# EAGLE design fb_in_8_230V (EAGLE 5.00)
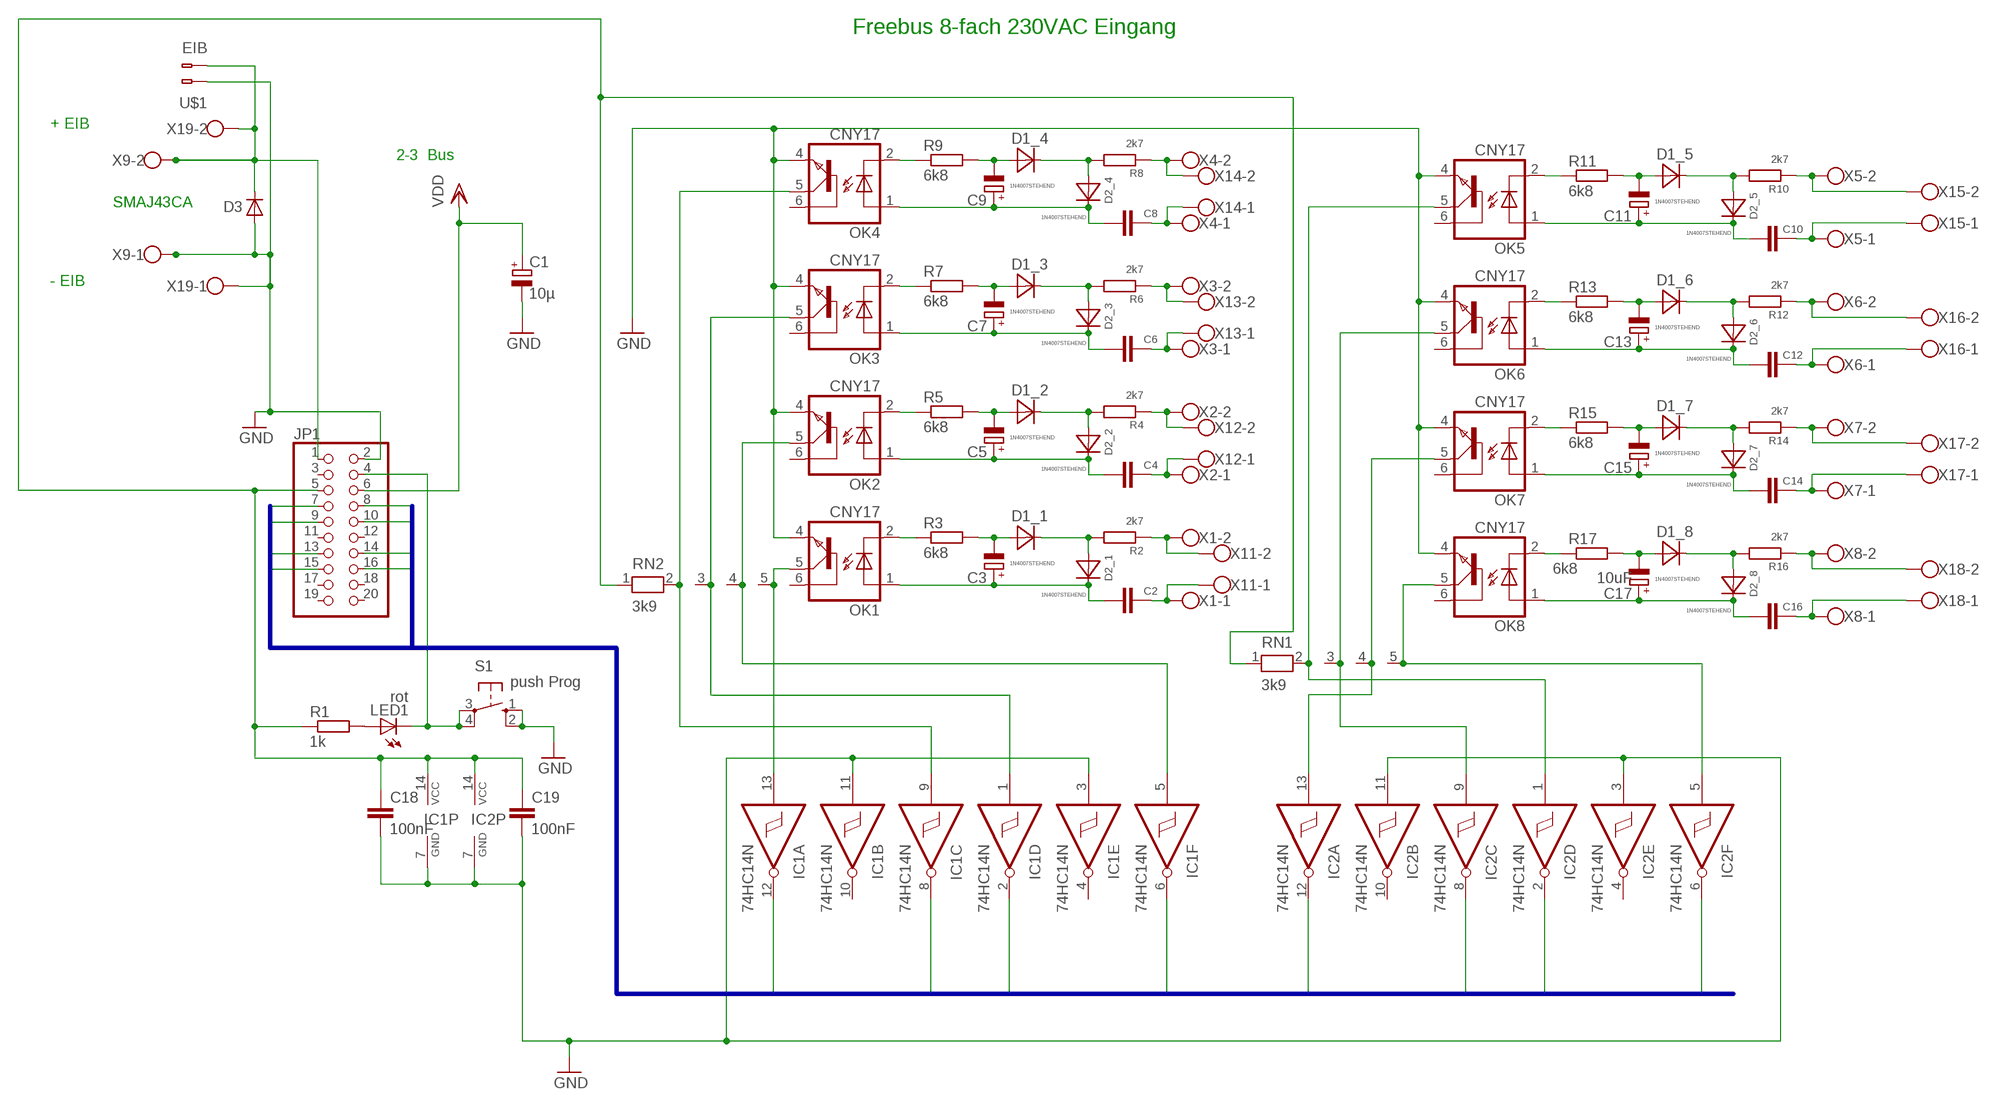
[diagram p0: schematic, sheet 1]

## Parts
C1  10µ  CPOL-EUE3.5-8  [E3,5-8]
C2  C-EU075-063X106  [C075-063X106]
C3  CPOL-EUE2-4  [E2-4]
C4  C-EU075-063X106  [C075-063X106]
C5  CPOL-EUE2-4  [E2-4]
C6  C-EU075-063X106  [C075-063X106]
C7  CPOL-EUE2-4  [E2-4]
C8  C-EU075-063X106  [C075-063X106]
C9  CPOL-EUE2-4  [E2-4]
C10  C-EU075-063X106  [C075-063X106]
C11  CPOL-EUE2-4  [E2-4]
C12  C-EU075-063X106  [C075-063X106]
C13  CPOL-EUE2-4  [E2-4]
C14  C-EU075-063X106  [C075-063X106]
C15  CPOL-EUE2-4  [E2-4]
C16  47nF  C-EU075-063X106  [C075-063X106]
C17  10uF  CPOL-EUE2-4  [E2-4]
C18  100nF  C-EU050-024X044  [C050-024X044]
C19  100nF  C-EU050-024X044  [C050-024X044]
D1_1  1N4007STEHEND  [RAD2,5]
D1_2  1N4007STEHEND  [RAD2,5]
D1_3  1N4007STEHEND  [RAD2,5]
D1_4  1N4007STEHEND  [RAD2,5]
D1_5  1N4007STEHEND  [RAD2,5]
D1_6  1N4007STEHEND  [RAD2,5]
D1_7  1N4007STEHEND  [RAD2,5]
D1_8  1N4007STEHEND  [RAD2,5]
D2_1  1N4007STEHEND  [RAD2,5]
D2_2  1N4007STEHEND  [RAD2,5]
D2_3  1N4007STEHEND  [RAD2,5]
D2_4  1N4007STEHEND  [RAD2,5]
D2_5  1N4007STEHEND  [RAD2,5]
D2_6  1N4007STEHEND  [RAD2,5]
D2_7  1N4007STEHEND  [RAD2,5]
D2_8  1N4007STEHEND  [RAD2,5]
D3  D-SMB  [SMB]
IC1  74HC14N  [DIL14]
IC2  74HC14N  [DIL14]
JP1  PINHD-2X10  [2X10]
LED1  rot  LED3MM  [LED3MM]
OK1  CNY17  [DIL06]
OK2  CNY17  [DIL06]
OK3  CNY17  [DIL06]
OK4  CNY17  [DIL06]
OK5  CNY17  [DIL06]
OK6  CNY17  [DIL06]
OK7  CNY17  [DIL06]
OK8  CNY17  [DIL06]
R1  1k  R-EU_0204/7  [0204/7]
R2  2k7  R-EU_0207/2V  [0207/2V]
R3  6k8  R-EU_0207/2V  [0207/2V]
R4  2k7  R-EU_0207/2V  [0207/2V]
R5  6k8  R-EU_0207/2V  [0207/2V]
R6  2k7  R-EU_0207/2V  [0207/2V]
R7  6k8  R-EU_0207/2V  [0207/2V]
R8  2k7  R-EU_0207/2V  [0207/2V]
R9  6k8  R-EU_0207/2V  [0207/2V]
R10  2k7  R-EU_0207/2V  [0207/2V]
R11  6k8  R-EU_0207/2V  [0207/2V]
R12  2k7  R-EU_0207/2V  [0207/2V]
R13  6k8  R-EU_0207/2V  [0207/2V]
R14  2k7  R-EU_0207/2V  [0207/2V]
R15  6k8  R-EU_0207/2V  [0207/2V]
R16  2k7  R-EU_0207/2V  [0207/2V]
R17  6k8  R-EU_0207/2V  [0207/2V]
RN1  3k9  RN04  [RN-5]
RN2  3k9  RN04  [RN-5]
S1  push Prog  10-XX  [B3F-10XX]
U$1  EIB  [BUSKLEMME243-724]
X1  W237-102W2POL5_08  [W237-132]
X2  W237-102W2POL5_08  [W237-132]
X3  W237-102W2POL5_08  [W237-132]
X4  W237-102W2POL5_08  [W237-132]
X5  W237-102W2POL5_08  [W237-132]
X6  W237-102W2POL5_08  [W237-132]
X7  W237-102W2POL5_08  [W237-132]
X8  W237-102W2POL5_08  [W237-132]
X9  W237-102W2POL5_08  [W237-132]
X11  W237-102AKL007-2P  [AKL007-02]
X12  W237-102AKL007-2P  [AKL007-02]
X13  W237-102AKL007-2P  [AKL007-02]
X14  W237-102AKL007-2P  [AKL007-02]
X15  W237-102AKL007-2P  [AKL007-02]
X16  W237-102AKL007-2P  [AKL007-02]
X17  W237-102AKL007-2P  [AKL007-02]
X18  W237-102AKL007-2P  [AKL007-02]
X19  W237-102AKL007-2P  [AKL007-02]

## Nets
230+_1: C2.1 C3.+ D2_1.C OK1.1(A)
230+_2: C4.1 C5.+ D2_2.C OK2.1(A)
230+_3: C6.1 C7.+ D2_3.C OK3.1(A)
230+_4: C8.1 C9.+ D2_4.C OK4.1(A)
230+_5: C10.1 C11.+ D2_5.C OK5.1(A)
230+_6: C12.1 C13.+ D2_6.C OK6.1(A)
230+_7: C14.1 C15.+ D2_7.C OK7.1(A)
230+_8: C16.1 C17.+ D2_8.C OK8.1(A)
230-_1: C3.- D1_1.A R3.2
230-_2: C5.- D1_2.A R5.2
230-_3: C7.- D1_3.A R7.2
230-_4: C9.- D1_4.A R9.2
230-_5: C11.- D1_5.A R11.2
230-_6: C13.- D1_6.A R13.2
230-_7: C15.- D1_7.A R15.2
230-_8: C17.- D1_8.A R17.2
230N_1: D1_1.C D2_1.A R2.2
230N_2: D1_2.C D2_2.A R4.2
230N_3: D1_3.C D2_3.A R6.2
230N_4: D1_4.C D2_4.A R8.2
230N_5: D1_5.C D2_5.A R10.2
230N_6: D1_6.C D2_6.A R12.2
230N_7: D1_7.C D2_7.A R14.2
230N_8: D1_8.C D2_8.A R16.2
GND: C1.- C18.2 C19.2 D3.2(A) IC1.3(E:I) IC1.7(P:GND) IC1.11(B:I) IC2.3(E:I) IC2.7(P:GND) IC2.11(B:I) JP1.2 OK1.4(EMI) OK2.4(EMI) OK3.4(EMI) OK4.4(EMI) OK5.4(EMI) OK6.4(EMI) OK7.4(EMI) OK8.4(EMI) S1.1(S) S1.2(S1) U$1.1(B-1) X9.1 X19.1
IO1: IC1.12(A:O) JP1.7
IO2: IC1.6(F:O) JP1.8
IO3: IC1.2(D:O) JP1.9
IO4: IC1.8(C:O) JP1.10
IO5: IC2.2(D:O) JP1.13
IO6: IC2.8(C:O) JP1.14
IO7: IC2.12(A:O) JP1.15
IO8: IC2.6(F:O) JP1.16
N$1: C8.2 X4.1 X14.1
N$2: R8.1 X4.2 X14.2
N$3: C6.2 X3.1 X13.1
N$4: R6.1 X3.2 X13.2
N$5: C4.2 X2.1 X12.1
N$6: R4.1 X2.2 X12.2
N$7: C2.2 X1.1 X11.1
N$8: R2.1 X1.2 X11.2
N$9: R12.1 X6.2 X16.2
N$10: C12.2 X6.1 X16.1
N$11: R14.1 X7.2 X17.2
N$12: C16.2 X8.1 X18.1
N$13: R10.1 X5.2 X15.2
N$14: C10.2 X5.1 X15.1
N$15: C14.2 X7.1 X17.1
N$16: R16.1 X8.2 X18.2
N$18: IC2.1(D:I) OK5.5(COL) RN1.2
N$19: IC2.9(C:I) OK6.5(COL) RN1.3
N$20: D3.1(C) JP1.1 U$1.2(B-2) X9.2 X19.2
N$21: IC2.13(A:I) OK7.5(COL) RN1.4
N$22: IC2.5(F:I) OK8.5(COL) RN1.5
N$23: IC1.13(A:I) OK1.5(COL) RN2.5
N$25: IC1.5(F:I) OK2.5(COL) RN2.4
N$27: JP1.4 LED1.K(C) S1.3(P) S1.4(P1)
N$28: LED1.A R1.2
N$29: IC1.1(D:I) OK3.5(COL) RN2.3
N$30: IC1.9(C:I) OK4.5(COL) RN2.2
OPT_1: OK1.2(C) R3.1
OPT_2: OK2.2(C) R5.1
OPT_3: OK3.2(C) R7.1
OPT_4: OK4.2(C) R9.1
OPT_5: OK5.2(C) R11.1
OPT_6: OK6.2(C) R13.1
OPT_7: OK7.2(C) R15.1
OPT_8: OK8.2(C) R17.1
VCC: C18.1 C19.1 IC1.14(P:VCC) IC2.14(P:VCC) JP1.5 R1.1 RN1.1 RN2.1
VDD: C1.+ JP1.6
Unconnected: IC1.4(E:O) IC1.10(B:O) IC2.4(E:O) IC2.10(B:O) JP1.3 JP1.11 JP1.12 JP1.17 JP1.18 JP1.19 JP1.20 OK1.6(BAS) OK2.6(BAS) OK3.6(BAS) OK4.6(BAS) OK5.6(BAS) OK6.6(BAS) OK7.6(BAS) OK8.6(BAS)

## Buses
IO[1..8]

## Notes on the sheet
- Freebus 8-fach 230VAC Eingang
- + EIB
- 2-3  Bus
- SMAJ43CA
- - EIB

## Library data of the parts
C1 C3 C5 C7 C9 C11 C13 C15 C17 = rcl:CPOL-EU: POLARIZED CAPACITOR, European symbol
C2 C4 C6 C8 C10 C12 C14 C16 C18 C19 = rcl:C-EU: CAPACITOR, European symbol
D1_1-D1_8 D2_1-D2_8 = diode:1N4007
D3 = semicon-smd-ipc:D-: DIODE unfilled
IC1 IC2 = 74xx-eu:74*14: Hex schmitt trigger INVERTER
JP1 = pinhead:PINHD-2X10: PIN HEADER
LED1 = led:LED: LED OSRAM: - CHIPLED LG R971, LG N971, LY N971, LG Q971, LY Q971, LO R971, LY R971 LH N974, LH R974 LS Q976, LO Q976, LY Q976 LO Q996 - Hyper CHIPLED LW Q18S LB Q993, LB Q99A, LB R99A - SideLED LS A670, LO A670, LY A670, LG A670, LP A670 LB A673, LV A673, LT A673, LW A673 LH A674 LY A675 LS A676, LA A676, LO A676, LY A676, LW A676 LS A679, LY A679, LG A679 - Hyper Micro SIDELED® LS Y876, LA Y876, LO Y876, LY Y876 LT Y87S - SmartLED LW L88C, LW L88S LB L89C, LB L89S, LG L890 LS L89K, LO L89K, LY L89K LS L896, LA L896, LO L896, LY L896 - TOPLED LS T670, LO T670, LY T670, LG T670, LP T670 LSG T670, LSP T670, LSY T670, LOP T670, LYG T670 LG T671, LOG T671, LSG T671 LB T673, LV T673, LT T673, LW T673 LH T674 LS T676, LA T676, LO T676, LY T676, LB T676, LH T676, LSB T676, LW T676 LB T67C, LV T67C, LT T67C, LS T67K, LO T67K, LY T67K, LW E67C LS E67B, LA E67B, LO E67B, LY E67B, LB E67C, LV E67C, LT E67C LW T67C LS T679, LY T679, LG T679 LS T770, LO T770, LY T770, LG T770, LP T770 LB T773, LV T773, LT T773, LW T773 LH T774 LS E675, LA E675, LY E675, LS T675 LS T776, LA T776, LO T776, LY T776, LB T776 LHGB T686 LT T68C, LB T68C - Hyper Mini TOPLED® LB M676 - Mini TOPLED Santana® LG M470 LS M47K, LO M47K, LY M47K Source: http://www.osram.convergy.de - LUMILED® LXK2-PW12-R00, LXK2-PW12-S00, LXK2-PW14-U00, LXK2-PW14-V00 LXK2-PM12-R00, LXK2-PM12-S00, LXK2-PM14-U00 LXK2-PE12-Q00, LXK2-PE12-R00, LXK2-PE12-S00, LXK2-PE14-T00, LXK2-PE14-U00 LXK2-PB12-K00, LXK2-PB12-L00, LXK2-PB12-M00, LXK2-PB14-N00, LXK2-PB14-P00, LXK2-PB14-Q00 LXK2-PR12-L00, LXK2-PR12-M00, LXK2-PR14-Q00, LXK2-PR14-R00 LXK2-PD12-Q00, LXK2-PD12-R00, LXK2-PD12-S00 LXK2-PH12-R00, LXK2-PH12-S00 LXK2-PL12-P00, LXK2-PL12-Q00, LXK2-PL12-R00 Source: www.luxeon.com
OK1-OK8 = optocoupler:CNY17: SIEMENS OPTO COUPLER
R1-R17 = rcl:R-EU_: RESISTOR, European symbol
RN1 RN2 = resistor-net:RN04: RESISTOR NETWORK
S1 = switch-omron:10-XX: OMRON SWITCH
U$1 = con-wago:EIB
X1-X9 X11-X19 = con-wago-500:W237-102: WAGO SCREW CLAMP

## Board
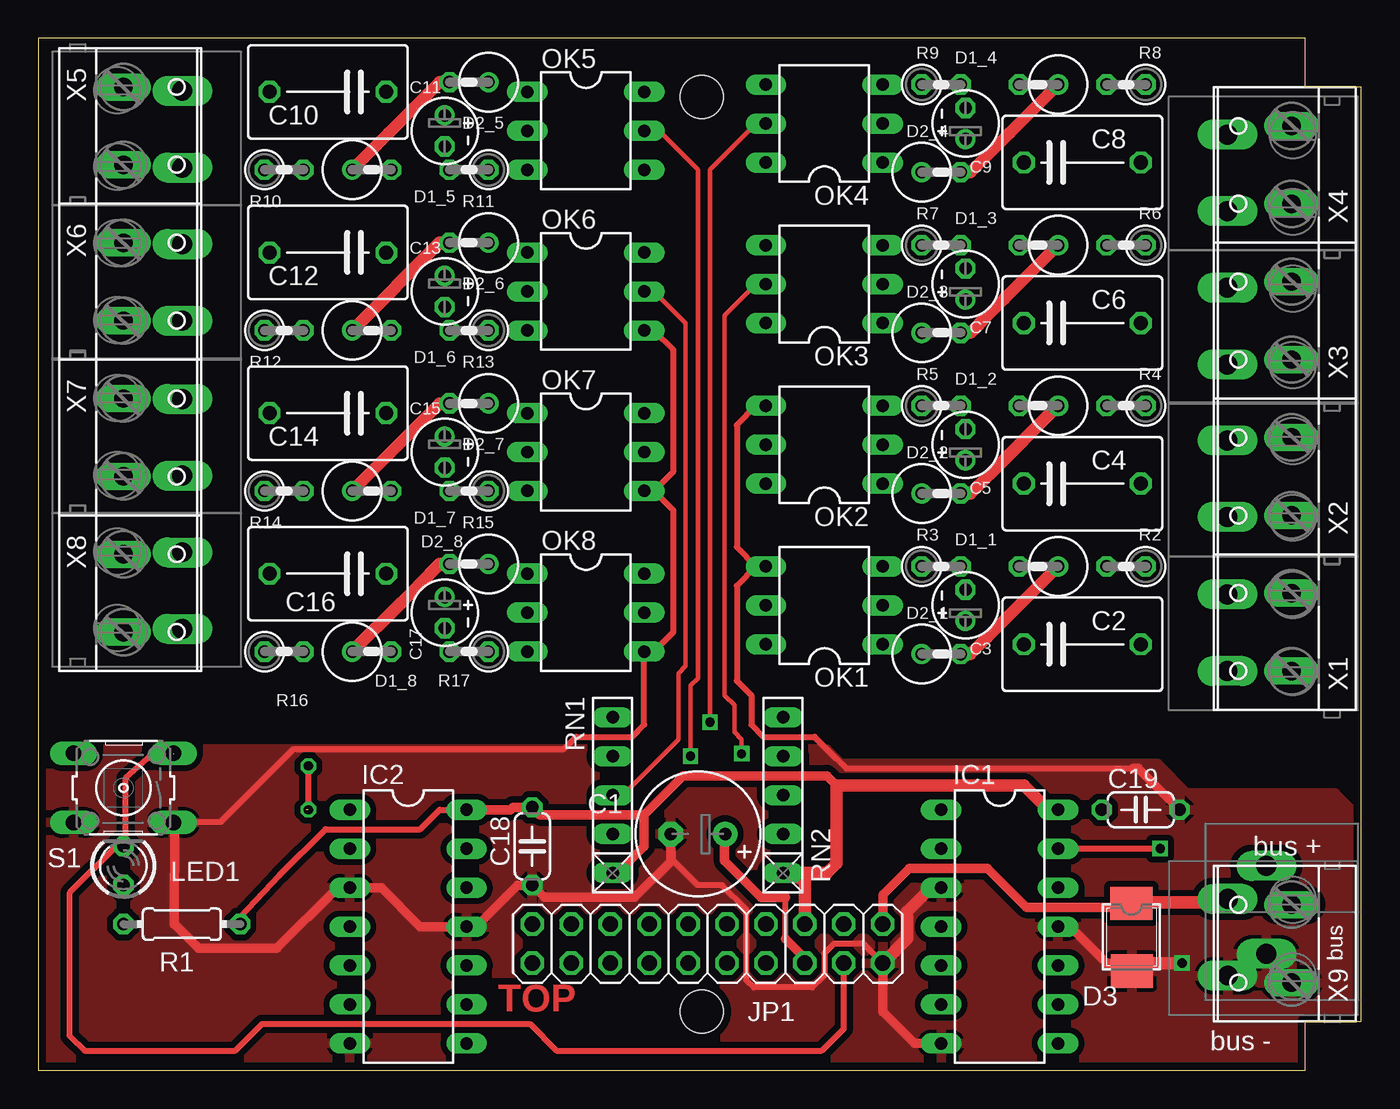
[diagram p1: board, top side]
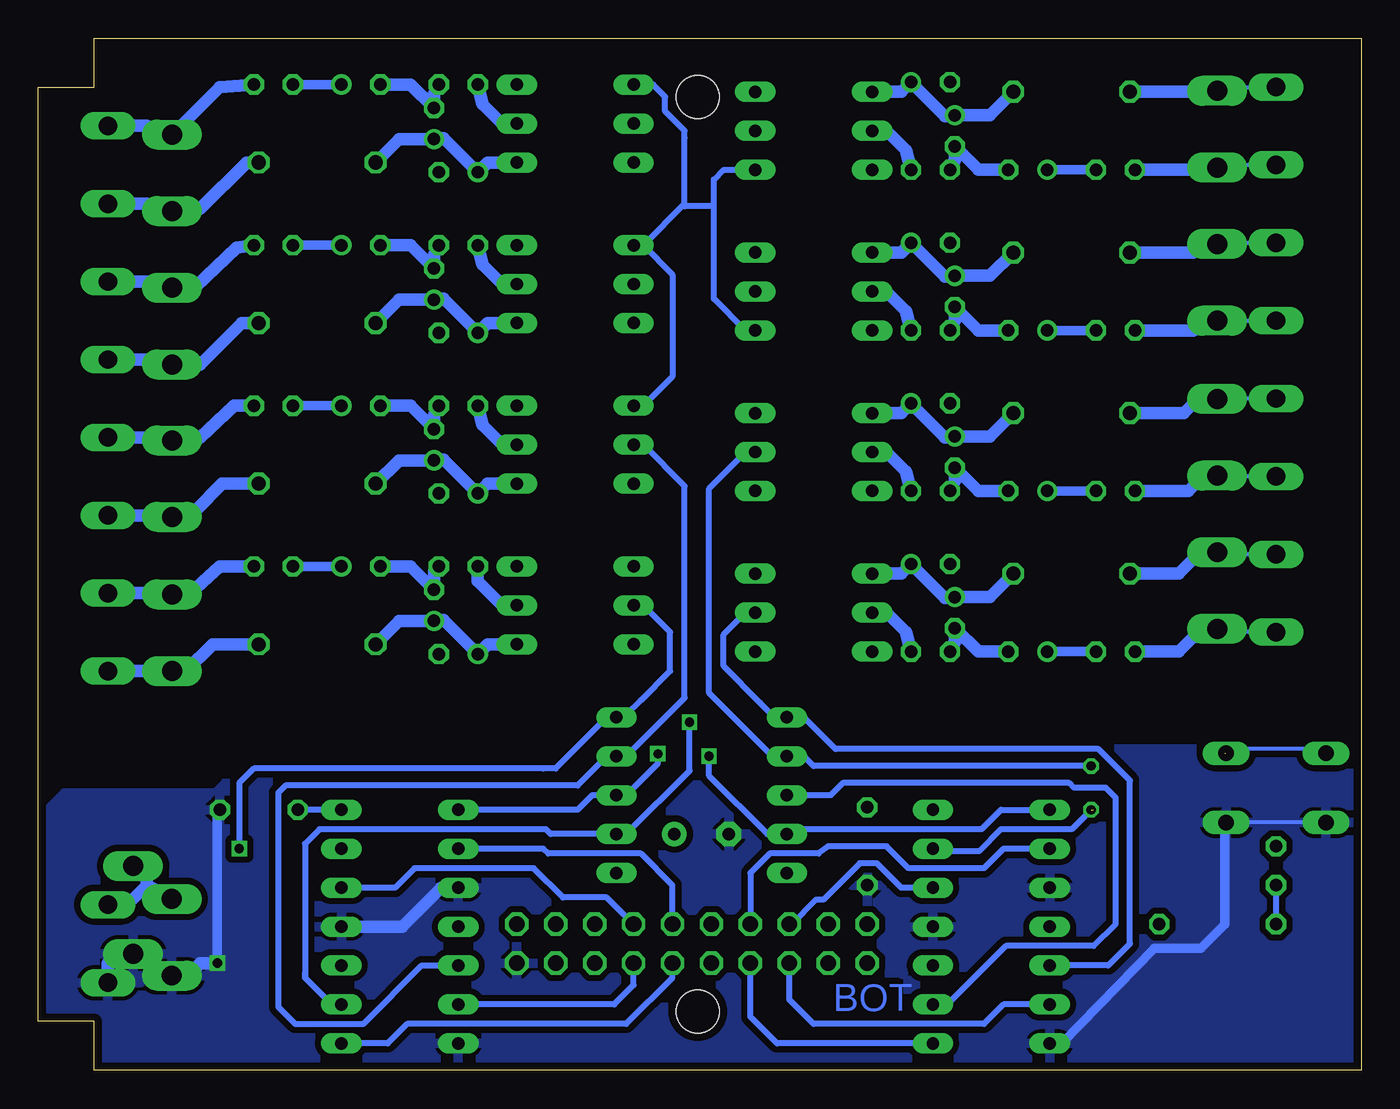
[diagram p2: board, bottom side, seen from below]

Size 86.28 x 67.31 mm. Coordinates in mm from the lower left corner, seen from the top.
Outline: 0,0.01 82.64,0 82.64,3.18 86.28,3.18 86.28,64.13 82.64,64.13 82.64,67.31 0,67.31 0,0.01
Copper layers (1*16): Top 0.035mm / dielectric 1.5mm / Bottom 0.035mm
Design rules "default": minimum track width 10mil, minimum drill 24mil, track to track 16mil, track to pad 12mil, pad to pad 16mil, via to via 16mil, smd to smd 8mil, copper to edge 20mil, drill to drill 10mil, minimum pad ring 10mil, minimum via ring 8mil, stop-mask expansion 4mil, vias tented up to drill 0mil, thermal gap 10mil
Holes 2.8 mm at 43.27,3.81 43.27,63.5

### Footprints (pad centres in the part's own frame; a part is rotated, then mirrored left to right if it is on the bottom)
E3,5-8 = drill 0.813 pad 1.6 round: + -1.778,0 | drill 0.813 pad 1.6 octagon: - 1.778,0
C075-063X106 = drill 0.914 octagon: 1 -3.81,0; 2 3.81,0
E2-4 = drill 0.813 pad 1.27 round: + -1.016,0 | drill 0.813 pad 1.27 octagon: - 1.016,0
C050-024X044 = drill 0.813 octagon: 1 -2.54,0; 2 2.54,0
RAD2,5 = drill 0.813 octagon: A 1.27,0 | drill 0.813 round: C -1.27,0
SMB = smd 2.159 x 2.743: 1 -2.311,-0.127; 2 2.108,-0.102
DIL14 = drill 0.813 long: 1 -7.62,-3.81; 2 -5.08,-3.81; 3 -2.54,-3.81; 4 0,-3.81; 5 2.54,-3.81; 6 5.08,-3.81; 7 7.62,-3.81; 8 7.62,3.81; 9 5.08,3.81; 10 2.54,3.81; 11 0,3.81; 12 -2.54,3.81; 13 -5.08,3.81; 14 -7.62,3.81
2X10 = drill 1.016 octagon: 1 -11.43,-1.27; 2 -11.43,1.27; 3 -8.89,-1.27; 4 -8.89,1.27; 5 -6.35,-1.27; 6 -6.35,1.27; 7 -3.81,-1.27; 8 -3.81,1.27; 9 -1.27,-1.27; 10 -1.27,1.27; 11 1.27,-1.27; 12 1.27,1.27; 13 3.81,-1.27; 14 3.81,1.27; 15 6.35,-1.27; 16 6.35,1.27; 17 8.89,-1.27; 18 8.89,1.27; 19 11.43,-1.27; 20 11.43,1.27
LED3MM = drill 0.813 octagon: A -1.27,0; K 1.27,0
DIL06 = drill 0.813 long: 1 -2.54,-3.81; 2 0,-3.81; 3 2.54,-3.81; 4 2.54,3.81; 5 0,3.81; 6 -2.54,3.81
0204/7 = drill 0.813 octagon: 1 -3.81,0; 2 3.81,0
0207/2V = drill 0.813 octagon: 1 -1.27,0; 2 1.27,0
RN-5 = drill 0.813 long: 1 -5.08,0; 2 -2.54,0; 3 0,0; 4 2.54,0; 5 5.08,0
B3F-10XX = drill 1.016 long: 1 -3.251,2.261; 2 3.251,2.261; 3 -3.251,-2.261; 4 3.251,-2.261
BUSKLEMME243-724 = drill 1.3 long: 1 -2.875,0; 2 2.875,0
W237-132 = drill 1.194 long: 1 -2.54,-0.635; 2 2.54,-0.635
AKL007-02 = drill 1.3 long: 1 -2.45,2.325; 2 2.55,2.325

### Placement (x,y rotation side)
C1  43.02,15.4 180 top
C2  68.1,27.78 0 top
C3  60.48,30.32 90 top
C4  68.1,38.26 0 top
C5  60.48,40.8 90 top
C6  68.1,48.74 0 top
C7  60.48,51.28 90 top
C8  68.1,59.21 0 top
C9  60.48,61.75 90 top
C10  18.88,63.82 180 top
C11  26.5,61.28 270 top
C12  18.88,53.34 180 top
C13  26.5,50.8 270 top
C14  18.88,42.86 180 top
C15  26.5,40.32 270 top
C16  18.88,32.38 180 top
C17  26.5,29.85 270 top
C18  32.22,14.61 270 top
C19  71.91,16.99 0 top
D1_1  65.24,32.86 180 top
D1_2  65.24,43.34 180 top
D1_3  65.24,53.82 180 top
D1_4  65.24,64.29 180 top
D1_5  21.74,58.74 0 top
D1_6  21.74,48.26 0 top
D1_7  21.74,37.78 0 top
D1_8  21.74,27.31 0 top
D2_1  58.89,27.15 0 top
D2_2  58.89,37.62 0 top
D2_3  58.89,48.1 0 top
D2_4  58.89,58.58 0 top
D2_5  28.09,64.45 180 top
D2_6  28.09,53.98 180 top
D2_7  28.09,43.5 180 top
D2_8  28.09,33.02 180 top
D3  71.43,8.57 270 top
IC1  62.7,9.37 270 top
IC2  24.12,9.37 270 top
JP1  43.65,8.26 180 top
LED1  5.55,13.33 90 top
OK1  51.27,30.32 90 top
OK2  51.27,40.8 90 top
OK3  51.27,51.28 90 top
OK4  51.27,61.75 90 top
OK5  35.71,61.28 270 top
OK6  35.71,50.8 270 top
OK7  35.71,40.32 270 top
OK8  35.71,29.85 270 top
R1  9.36,9.52 180 top
R2  70.95,32.86 180 top
R3  58.89,32.86 0 top
R4  70.95,43.34 180 top
R5  58.89,43.34 0 top
R6  70.95,53.82 180 top
R7  58.89,53.82 0 top
R8  70.95,64.29 180 top
R9  58.89,64.29 0 top
R10  16.03,58.74 0 top
R11  28.09,58.74 180 top
R12  16.03,48.26 0 top
R13  28.09,48.26 180 top
R14  16.03,37.78 0 top
R15  28.09,37.78 180 top
R16  16.03,27.31 0 top
R17  28.09,27.31 180 top
RN1  37.46,17.94 90 top
RN2  48.57,17.94 90 top
S1  5.55,18.42 180 top
U$1  80.11,10.45 90 top
X1  81.11,28.58 90 top
X2  81.11,38.73 90 top
X3  81.11,48.89 90 top
X4  81.11,59.05 90 top
X5  6.18,61.59 270 top
X6  6.18,51.43 270 top
X7  6.18,41.27 270 top
X8  6.18,31.12 270 top
X9  81.11,8.26 90 top
X11  79.89,28.49 90 top
X12  79.89,38.53 90 top
X13  79.89,48.49 90 top
X14  79.89,58.49 90 top
X15  7.07,61.43 270 top
X16  7.07,51.43 270 top
X17  7.07,41.34 270 top
X18  7.07,31.34 270 top
X19  79.9,8.62 90 top

### Tracks (layer width: path | path; a pad name or v marks a point on that pad's centre or on a via)
230+_1
  Bottom 0.813: OK1.1 56.98,27.78 D2_1.C 59.84,29.37 60.48,29.37 C3.+ 62.76,29.31 C2.1
230+_2
  Bottom 0.813: OK2.1 56.98,38.26 D2_2.C 59.84,39.85 60.48,39.85 C5.+ 62.76,39.78 C4.1
230+_3
  Bottom 0.813: OK3.1 56.98,48.74 D2_3.C 59.84,50.32 60.48,50.32 C7.+ 62.76,50.26 C6.1
230+_4
  Bottom 0.813: OK4.1 56.98,59.21 D2_4.C 59.84,60.8 60.48,60.8 C9.+ 62.76,60.74 C8.1
230+_5
  Bottom 0.813: OK5.1 30,63.82 D2_5.C 27.14,62.23 26.5,62.23 C11.+ 24.22,62.29 C10.1
230+_6
  Bottom 0.813: OK6.1 30,53.34 D2_6.C 27.14,51.75 26.5,51.75 C13.+ 24.22,51.82 C12.1
230+_7
  Bottom 0.813: OK7.1 30,42.86 D2_7.C 27.14,41.27 26.5,41.27 C15.+ 24.22,41.34 C14.1
230+_8
  Bottom 0.813: OK8.1 30,32.38 D2_8.C 27.14,30.8 26.5,30.8 C17.+ 24.22,30.86 C16.1
230-_1
  Bottom 0.813: C3.- 60.48,31.27 | R3.2 60.48,32.54 C3.- | C3.- 62,32.86 D1_1.A
230-_2
  Bottom 0.813: C5.- 60.48,41.75 | R5.2 60.48,42.7 C5.- | C5.- 62,43.34 D1_2.A
230-_3
  Bottom 0.813: C7.- 60.48,52.23 | R7.2 60.48,53.18 C7.- | C7.- 62,53.82 D1_3.A
230-_4
  Bottom 0.813: C9.- 60.48,62.71 | R9.2 60.48,63.66 C9.- | C9.- 62,64.29 D1_4.A
230-_5
  Bottom 0.813: C11.- 26.5,60.32 | R11.2 26.5,59.37 C11.- | C11.- 24.98,58.74 D1_5.A
230-_6
  Bottom 0.813: C13.- 26.5,49.85 | R13.2 26.5,48.89 C13.- | C13.- 24.98,48.26 D1_6.A
230-_7
  Bottom 0.813: C15.- 26.5,39.37 | R15.2 26.5,38.42 C15.- | C15.- 24.98,37.78 D1_7.A
230-_8
  Bottom 0.813: C17.- 26.5,28.89 | R17.2 26.5,27.94 C17.- | C17.- 24.98,27.31 D1_8.A
230N_1
  Top 0.813: 60.8,27.15 | D2_1.A 60.8,27.15 | 60.8,27.15 61.91,28.26 D1_1.C
  Bottom 0.61: D1_1.C R2.2
230N_2
  Top 0.813: D2_2.A 60.8,37.62 61.27,38.1 62.06,38.89 D1_2.C
  Bottom 0.61: D1_2.C R4.2
230N_3
  Top 0.813: D2_3.A 60.8,48.1 61.11,48.42 61.59,48.89 63.02,50.32 D1_3.C
  Bottom 0.61: D1_3.C R6.2
230N_4
  Top 0.813: D2_4.A 60.8,58.58 61.75,59.53 63.34,61.12 D1_4.C
  Bottom 0.61: D1_4.C R8.2
230N_5
  Top 0.813: D2_5.A 26.19,64.45 25.39,63.66 24.44,62.71 22.85,61.12 D1_5.C
  Bottom 0.61: R10.2 D1_5.C
230N_6
  Top 0.813: D2_6.A 26.19,53.98 D1_6.C
  Bottom 0.61: R12.2 D1_6.C
230N_7
  Top 0.813: D2_7.A 26.19,43.5 D1_7.C
  Bottom 0.61: R14.2 D1_7.C
230N_8
  Top 0.813: D2_8.A 26.19,33.02 24.76,31.59 23.65,30.48 D1_8.C
  Bottom 0.61: R16.2 D1_8.C
GND  (via drill 0.6)
  Top 0.406: OK6.4 40.16,48.26 41.43,46.99 41.43,39.05 40.16,37.78 | 40.16,37.78 41.43,36.51 41.43,28.58 40.16,27.31 OK8.4 39.52,22.54 38.73,21.75 35.08,21.75 34.28,20.96 16.66,20.96 11.9,16.19 8.88,16.19 8.84,16.19 S1.1 | 40.16,37.78 OK7.4 | 46.82,32.86 45.55,34.13 45.55,42.07 46.82,43.34 OK2.4 | 46.82,32.86 OK1.4 | 46.82,32.86 47.62,32.86 | 46.82,32.86 45.55,31.59 45.55,25.4 46.51,24.45 46.51,22.54 47.3,21.75 50.63,21.75 52.06,20.32 52.7,19.69 71.43,19.69 | IC2.11 28.57,9.37 | 28.57,9.37 | IC2.11 | 41.27,13.81 43.02,12.06 44.6,12.06 46.19,10.48 46.19,5.87 46.67,5.4 50.48,5.4 51.27,6.19 51.27,7.62 51.91,8.26 53.81,8.26 54.29,7.78 | 54.29,7.78 | JP1.2 54.29,7.78 | IC2.3
  Top 0.61: JP1.2 55.08,3.81 57.14,1.75 IC1.7 | IC1.3 | IC1.3 58.73,11.75 | 28.57,9.37 30.47,11.27 31.27,12.06 C18.2 33.01,11.27 38.89,11.27 | 38.89,11.27 38.41,11.27 | 38.89,11.27 41.27,13.62 C1.- | IC2.11 24.92,9.37 22.38,11.91 IC2.3 19.52,11.91 15.55,7.94 10.47,7.94 8.96,9.45 8.88,9.53 8.88,16.19 | IC1.11 67.3,9.37 69.69,6.98 71.43,6.98 71.44,6.99 D3.2 | C19.2 71.75,19.69 71.43,19.69 | v74.61,6.98
  Top 0.813: D3.2 72.38,6.99 72.69,6.99 73.34,6.98 v74.61,6.98 | JP1.2 56.67,8.57 56.67,10.32 58.1,11.75 58.73,11.75
  Bottom 0.254: 81.75,6.98 U$1.1 79.21,6.98 | S1.1 8.09,16.19 3.01,16.19 S1.2
  Bottom 0.305: 46.67,64.29 46.82,64.29
  Bottom 0.406: 46.82,64.29 OK4.4 | 42.22,56.36 42.22,58.1 41.59,58.74 OK5.4 | OK6.4 40.16,48.26 42.22,50.32 42.22,56.36 | 44.13,56.52 46.82,53.82 | OK2.4 46.82,43.34 44.92,45.24 44.92,51.91 46.82,53.82 | 46.82,53.82 OK3.4 | 44.13,56.52 44.13,60.8 44.13,61.28 45.4,62.55 45.4,63.5 46.19,64.29 46.67,64.29 | 42.22,56.36 44.13,56.36 44.13,56.52
  Bottom 0.61: IC2.7 19.52,1.75 13.49,7.94 10.47,7.94 8.88,9.53 8.88,16.19 8.84,16.19 S1.1 | IC2.7 | v74.61,6.98 | C19.2 74.61,16.83 v74.61,6.98
  Bottom 0.813: 81.75,6.98 X9.1 | 79.21,6.98 X19.1 76.49,6.17 75.72,6.98 v74.61,6.98 | IC1.3 60,11.91 62.54,9.37 IC1.11
  pour Bottom (isolate 0.254): 0.31,20.96 10.31,20.96 11.42,20.96 51.43,20.96 52.38,20 73.02,20 73.5,19.53 73.5,19.37 74.77,18.1 84.61,18.1 85.72,16.99 85.72,4.13 85.4,3.81 82.07,3.81 82.07,0.48 0.63,0.48 0.31,0.79
  pour Top (isolate 0.254): 0.31,20.96 51.43,20.96 52.38,20 73.02,20 74.92,18.1 84.61,18.1 85.72,16.99 85.72,3.97 82.07,3.97 82.07,0.48 0.63,0.48 0.31,0.79 0.31,20
IO1
  Bottom 0.406: 47.3,9.53 JP1.7 49.21,11.27 52.06,11.27 53.97,13.18 61.75,13.18 63.02,11.91 IC1.12
IO2
  Bottom 0.406: JP1.8 47.46,5.56 48.73,4.29 IC1.6
IO3
  Bottom 0.406: JP1.9 44.92,12.06 46.98,14.13 53.02,14.13 53.33,14.45 IC1.2
IO4
  Bottom 0.406: JP1.10 44.92,6.03 47.94,3.02 62.22,3.02 63.49,1.75 IC1.8
IO5
  Bottom 0.406: IC2.2 23.33,14.45 24.6,13.18 29.52,13.18 30.95,14.61 34.76,14.61 35.39,14.13 38.57,14.13 39.84,12.86 JP1.13
IO6
  Bottom 0.406: IC2.8 38.09,1.75 39.84,3.49 JP1.14
IO7
  Bottom 0.406: IC2.12 30,11.91 31.58,13.49 32.7,13.49 35.08,11.11 35.55,11.11 37.14,9.53 JP1.15
IO8
  Bottom 0.406: IC2.6 23.33,4.29 24.6,3.02 35.71,3.02 37.3,4.6 JP1.16
N$1
  Bottom 0.254: X14.1 79.21,56.52
  Bottom 0.406: X14.1 77.47,56.04 77.3,56.2 75.72,56.2
  Bottom 0.813: 79.21,56.52 X4.1 | C8.2 72.7,59.21 75.72,56.2
N$2
  Bottom 0.254: X14.2 79.21,61.59
  Bottom 0.406: 77.62,60.96 77.56,61.02 X14.2
  Bottom 0.813: 79.21,61.59 X4.2 | R8.1 74.45,64.14 77.56,61.02
N$3
  Bottom 0.254: X13.1 79.21,46.35
  Bottom 0.406: 77.62,46.04 X13.1 75.72,46.04
  Bottom 0.813: 79.21,46.35 X3.1 | C6.2 73.02,48.74 75.72,46.04
N$4
  Bottom 0.254: X13.2 79.21,51.43
  Bottom 0.406: X13.2 77.56,51.06 77.62,51.12 76.03,51.12
  Bottom 0.813: 79.21,51.43 X3.2 | R6.1 73.34,53.66 76.03,51.12
N$5
  Bottom 0.254: X12.1 79.21,36.2
  Bottom 0.406: X12.1 77.56,36.14 77.62,36.2 77.3,36.51 76.03,36.51
  Bottom 0.813: 79.21,36.2 X2.1 | C4.2 74.29,38.26 76.03,36.51
N$6
  Bottom 0.254: X12.2 79.21,41.27
  Bottom 0.406: X12.2 77.56,41.22 77.62,41.27 75.72,41.27
  Bottom 0.813: 79.21,41.27 X2.2 | R4.1 73.5,43.34 75.72,41.27
N$7
  Bottom 0.254: X11.1 79.21,26.04
  Bottom 0.406: X11.1 77.62,26.04 76.67,26.04
  Bottom 0.813: 79.21,26.04 X1.1 | C2.2 74.92,27.78 76.67,26.04
N$8
  Bottom 0.254: X11.2 79.21,31.12
  Bottom 0.406: X11.2 77.56,31.06 77.62,31.12 76.35,31.12
  Bottom 0.813: 79.21,31.12 X1.2 | R2.1 74.45,32.86 76.35,31.12
N$9
  Bottom 0.254: X6.2 8.09,48.89 X16.2
  Bottom 0.406: X16.2
  Bottom 0.813: R12.1 10.95,48.26 10.63,48.58 9.68,48.58 9.37,48.88 | 9.37,48.88 9.36,48.89 | X16.2 9.37,48.88
N$10
  Bottom 0.254: X6.1 8.09,53.98 X16.1
  Bottom 0.406: X16.1 9.49,53.98
  Bottom 0.813: C12.2 10.95,53.34 10.31,53.98 9.36,53.98 9.4,53.94 X16.1
N$11
  Bottom 0.254: X7.2 8.09,38.73 X17.2
  Bottom 0.406: X17.2 9.45,38.73
  Bottom 0.813: R14.1 11.27,37.78 10.63,38.42 9.68,38.42 9.36,38.73 9.4,38.77 X17.2
N$12
  Bottom 0.254: X8.1 8.09,33.66 X18.1
  Bottom 0.406: X18.1 9.58,33.97
  Bottom 0.813: C16.2 11.9,32.38 10.95,33.34 9.68,33.34 9.36,33.66 9.4,33.69 X18.1
N$13
  Bottom 0.254: X5.2 8.09,59.05 X15.2
  Bottom 0.406: X15.2 9.57,59.05
  Bottom 0.813: 9.4,59.02 9.36,59.05 | X15.2 9.4,59.02 | R10.1 9.68,58.74 9.4,59.02
N$14
  Bottom 0.254: X5.1 8.09,64.14 X15.1
  Bottom 0.406: X15.1 9.65,64.14
  Bottom 0.813: X15.1 9.4,63.85 9.36,63.82 C10.2
N$15
  Bottom 0.254: X7.1 8.09,43.81 X17.1
  Bottom 0.406: X17.1 9.43,43.81
  Bottom 0.813: C14.2 11.58,42.86 10.95,43.5 9.68,43.5 X17.1 | X17.1 9.36,43.81 | X17.1
N$16
  Bottom 0.254: X8.2 8.09,28.58 X18.2
  Bottom 0.406: X18.2 9.5,28.89
  Bottom 0.813: R16.1 11.9,27.31 10.95,28.26 9.68,28.26 9.36,28.58 9.4,28.61 X18.2
N$18  (via drill 0.6)
  Top 0.305: 40.48,61.28 43.02,58.74 43.02,25.56 42.54,25.08 v42.54,20.48
  Top 0.406: 40.48,61.28 OK5.5
  Bottom 0.406: v42.54,20.48 42.54,19.21 38.73,15.4 RN1.2 36.51,15.72 30.47,15.72 26.03,15.72 24.76,15.72 23.49,16.99 IC2.1 | IC2.1
N$19
  Top 0.305: 40.16,50.8 42.22,48.74 42.22,26.35 41.74,25.88 41.74,21.59 38.09,17.94
  Top 0.406: 40.16,50.8 OK6.5 | RN1.3 38.09,17.94
  Bottom 0.406: RN1.3 34.6,17.94 33.81,18.73 19.04,18.73 18.73,18.42 16.66,18.42 16.03,17.78 16.03,9.53 17.46,8.1 23.17,8.1 26.98,4.29 IC2.9 | IC2.9
N$20
  Top 0.61: JP1.1 55.08,11.43 56.83,13.18 61.91,13.18 64.45,10.64 70.8,10.64 71.11,10.79 | 71.11,10.79 | 71.11,10.79 D3.1
  Top 0.813: D3.1 71.91,10.95 76.51,10.95 76.73,11.17 X19.2
  Bottom 0.254: 80.48,10.79 X9.2 | 79.21,13.33 U$1.2
  Bottom 0.813: 79.21,12.06 80.48,10.79 | 79.21,12.06 79.21,13.33 | X19.2 79.21,12.06
N$21  (via drill 0.6)  (1 unrouted)
  Top 0.406: v17.61,19.84 v17.61,16.99
  Bottom 0.406: OK7.5 40.16,40.32 42.54,37.94 42.54,24.61 41.59,23.65 38.41,20.48 RN1.4 36.35,20.48 35.71,19.84 v17.61,19.84 | IC2.13 27.77,14.29 24.92,14.29 23.49,15.72 18.88,15.72 v17.61,16.99
N$22
  Bottom 0.406: OK8.5 40.16,29.85 41.59,28.42 41.59,26.35 39.2,23.97 | 39.2,23.97 | 34.28,20.96 17.14,20.96 15.08,18.89 15.08,8.26 16.5,6.83 IC2.5 | 34.28,20.96 | 34.28,20.96 36.35,23.02 RN1.5 38.25,23.02 39.2,23.97 | 39.2,23.97 | IC2.5
N$23  (via drill 0.6)
  Top 0.406: v73.18,14.45 IC1.13
  Bottom 0.406: OK1.5 46.82,30.32 45.08,28.58 45.08,26.04 46.98,24.13 47.94,23.18 48.89,23.02 | 53.33,19.69 72.22,19.69 73.18,18.73 v73.18,14.45 | 53.33,19.69 | RN2.5 48.89,23.02 | 48.89,23.02 49.21,23.02 52.54,19.69 53.33,19.69 | IC1.13
N$25
  Bottom 0.406: OK2.5 46.82,40.8 44.13,38.1 44.13,24.29 45.55,22.86 47.94,20.48 48.89,20.48 | IC1.5 61.27,6.83 65.08,3.02 69.53,3.02 70.64,4.13 70.64,8.57 70.64,18.1 70.16,18.57 51.11,18.57 49.21,20.48 48.89,20.48 | RN2.4 48.89,20.48
N$27  (1 unrouted)
  Top 0.406: 5.71,15.4 5.71,14.76 LED1.K 5.07,14.61 2.06,11.59 2.06,2.22 3.01,1.27 12.85,1.27 14.6,3.02 32.06,3.02 33.81,1.27 51.11,1.27 52.54,2.7 JP1.4 | 5.71,15.4 | 5.71,15.4 5.71,19.05 7.46,20.64 8.84,20.64
  Bottom 0.254: 8.09,20.96 3.01,20.96 S1.4
  Bottom 0.406: 8.85,20.68 8.88,20.64 | 8.85,20.68 S1.3 | 8.09,20.96 8.57,20.96 8.85,20.68
N$28
  Bottom 0.406: R1.2 | R1.2 | R1.2 LED1.A
N$29  (via drill 0.6)
  Top 0.305: OK3.5 46.82,51.28 46.19,50.64 44.76,49.21 44.76,24.45 45.4,23.81 45.4,22.07 45.87,21.59 v45.87,20.64
  Bottom 0.406: v45.87,20.64 45.87,20 47.94,17.94 RN2.3 50.16,17.94 51.11,16.99 IC1.1
N$30  (via drill 0.6)
  Top 0.305: OK4.5 46.82,61.75 43.81,58.74 v43.81,22.7
  Top 0.406: v43.81,22.7
  Bottom 0.406: 68.89,6.03 68.89,14.76 67.94,15.72 53.17,15.72 52.86,15.4 RN2.2 47.94,15.4 43.81,19.53 v43.81,22.7 | 68.89,6.03 68.89,6.35 | IC1.9 67.14,4.29 68.89,6.03
OPT_1
  Bottom 0.813: OK1.2 56.03,30.32 57.62,31.91 R3.1
OPT_2
  Bottom 0.813: OK2.2 56.03,40.8 57.3,42.07 R5.1
OPT_3
  Bottom 0.813: OK3.2 56.03,51.28 57.3,52.55 R7.1
OPT_4
  Bottom 0.813: OK4.2 56.03,61.75 57.3,63.02 R9.1
OPT_5
  Bottom 0.813: OK5.2 30.95,61.28 29.68,60.01 R11.1
OPT_6
  Bottom 0.813: OK6.2 30.95,50.8 29.68,49.53 R13.1
OPT_7
  Bottom 0.813: OK7.2 30.95,40.32 29.68,39.05 R15.1
OPT_8
  Bottom 0.813: OK8.2 30.95,29.85 29.68,28.58 R17.1
VCC
  Top 0.406: IC2.14 | R1.1 13.17,10 15.71,12.7 18.73,15.72 24.92,15.72 26.19,16.99 IC2.14 | IC2.14
  Top 0.61: 52.06,18.57 | 52.06,18.57 | 52.06,18.57 52.22,18.57 | IC2.14 30.79,16.99 30.95,17.15 C18.1 | 39.52,16.67 42.06,19.21 43.17,19.21 51.43,19.21 52.06,18.57 | RN1.1 37.78,12.86 39.52,14.61 39.52,16.03 39.52,16.67 | C18.1 | C18.1 32.7,16.67 39.52,16.67 | IC1.14
  Top 0.813: 52.22,18.57 54.92,18.57 64.29,18.57 65.88,16.99 IC1.14 | JP1.5 50,12.38 RN2.1 51.43,12.86 52.06,13.49 52.06,18.57
  Bottom 0.406: C19.1 | IC1.14 C19.1
VDD
  Top 0.406: 48.73,8.57 48.73,11.27 | JP1.6 50,7.3 | 44.76,15.4 | C1.+ 44.76,15.4
  Top 0.61: C1.+ 44.76,14.57 44.76,13.65 47.14,11.27 48.73,11.27 | 50,7.3 48.73,8.57

### Text on the board
Top: TOP
Bottom: BOT
tPlace: bus + | bus | bus -
tValues: fb_in_8_230V_03